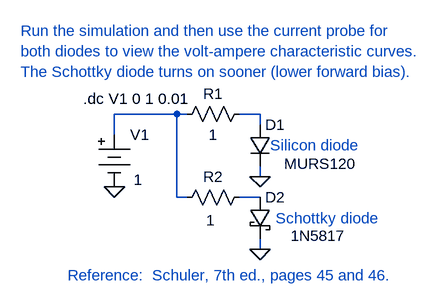
[diagram p0: schematic Diodes.asc]
Diodes.asc, the LTspice schematic file:
Version 4
SHEET 1 2024 848
WIRE -496 -464 -592 -464
WIRE -480 -464 -496 -464
WIRE -368 -464 -400 -464
WIRE -368 -448 -368 -464
WIRE -592 -432 -592 -464
WIRE -368 -368 -368 -384
WIRE -496 -336 -496 -464
WIRE -480 -336 -496 -336
WIRE -368 -336 -400 -336
WIRE -368 -256 -368 -272
FLAG -368 -368 0
FLAG -592 -352 0
FLAG -368 -256 0
SYMBOL res -384 -480 R90
WINDOW 0 0 56 VBottom 0
WINDOW 3 32 56 VTop 0
SYMATTR InstName R1
SYMATTR Value 1
SYMBOL diode -384 -448 R0
WINDOW 3 53 60 Left 0
SYMATTR Value MURS120
SYMATTR InstName D1
SYMBOL Misc\\battery -592 -448 R0
WINDOW 3 30 85 Left 0
WINDOW 123 0 0 Left 0
WINDOW 39 0 0 Left 0
SYMATTR Value 1
SYMATTR InstName V1
SYMBOL schottky -384 -336 R0
WINDOW 3 63 59 Left 0
SYMATTR Value 1N5817
SYMATTR InstName D2
SYMATTR Description Diode
SYMATTR Type diode
SYMBOL res -384 -352 R90
WINDOW 0 0 56 VBottom 0
WINDOW 3 36 60 VTop 0
SYMATTR InstName R2
SYMATTR Value 1
TEXT -640 -488 Left 0 !.dc V1 0 1 0.01
TEXT -736 -592 Left 0 ;Run the simulation and then use the current probe for\nboth diodes to view the volt-ampere characteristic curves.\nThe Schottky diode turns on sooner (lower forward bias).
TEXT -352 -416 Left 0 ;Silicon diode
TEXT -344 -304 Left 0 ;Schottky diode
TEXT -664 -216 Left 0 ;Reference:  Schuler, 7th ed., pages 45 and 46.

The netlist it stands for:
* Diodes.asc
R1 N002 N001 1
D1 N002 0 MURS120
V1 N001 0 1
D2 N003 0 1N5817
R2 N003 N001 1
.model D D
.lib standard.dio
.dc V1 0 1 0.01
* Run the simulation and then use the current probe for
* both diodes to view the volt-ampere characteristic curves.
* The Schottky diode turns on sooner (lower forward bias).
* Silicon diode
* Schottky diode
* Reference:  Schuler, 7th ed., pages 45 and 46.
.backanno
.end